# EAGLE design Main Board (EAGLE 6.1)
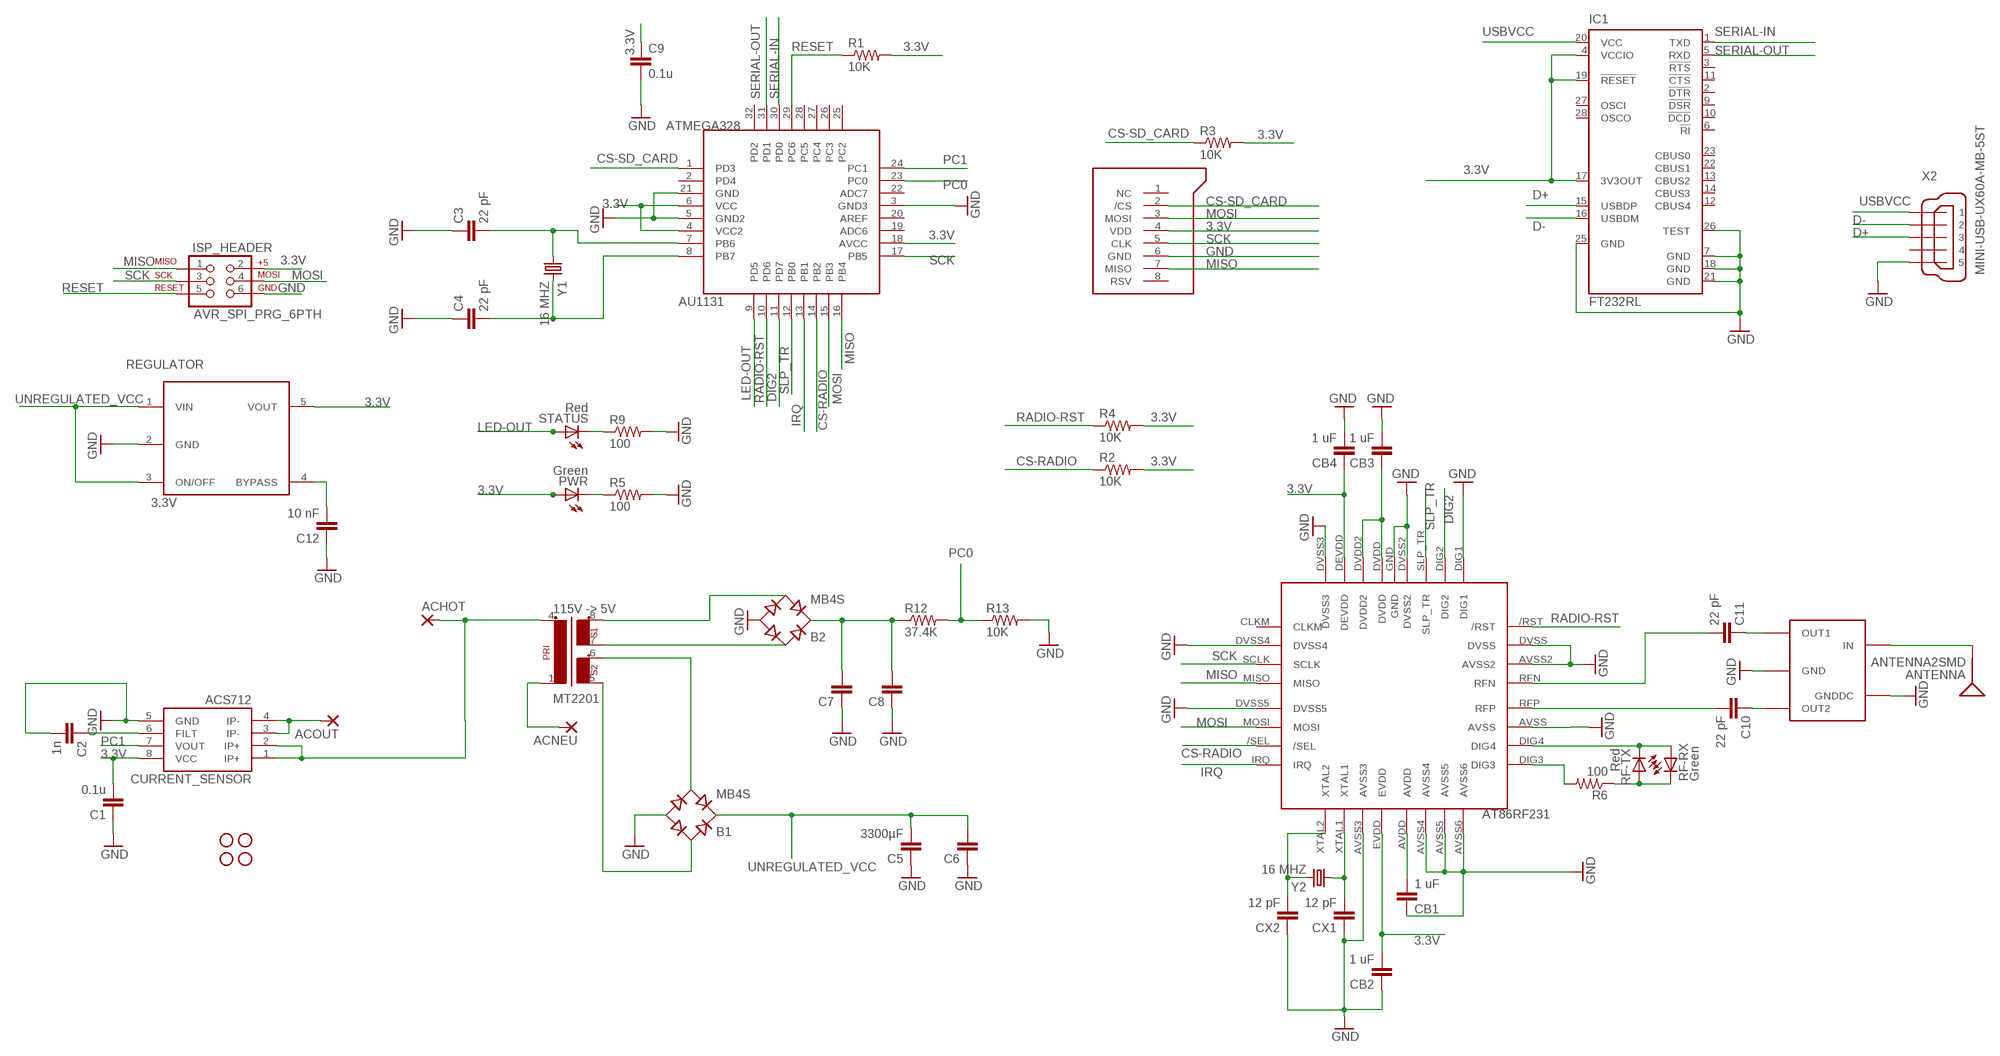
[diagram p0: schematic, sheet 1]

## Parts
3.3V_REGULATOR  REG3.3V  [SOT23-5]
ACHOT  PTH3MM  [PTH-3MM]
ACNEU  PTH3MM  [PTH-3MM]
ACOUT  PTH3MM  [PTH-3MM]
ANTENNA  ANTENNA2SMD  [ANTENNA-CHIP2]
AT86RF231  AT86RF231(RADIO)AT86RF231  [32QN2(RADIO)]
ATMEGA328  ATMEGA32832A  [TQFP32-08]
B1  MB4S  [SOIC-4]
B2  MB4S  [SOIC-4]
BALUN  WE-BAL  [WE-BAL]
C1  0.1u  CAP0603-CAP  [0603-CAP]
C2  1n  CAP0603-CAP  [0603-CAP]
C3  22 pF  CAP0603-CAP  [0603-CAP]
C4  22 pF  CAP0603-CAP  [0603-CAP]
C5  3300µF  CAPPTH1  [CAP-PTH-5MM]
C6  CAPPTH1  [CAP-PTH-5MM]
C7  CAPPTH1  [CAP-PTH-5MM]
C8  CAPPTH1  [CAP-PTH-5MM]
C9  0.1u  CAP0603-CAP  [0603-CAP]
C10  22 pF  CAP0603-CAP  [0603-CAP]
C11  22 pF  CAP0603-CAP  [0603-CAP]
C12  10 nF  CAP0603-CAP  [0603-CAP]
CB1  1 uF  CAP0603-CAP  [0603-CAP]
CB2  1 uF  CAP0603-CAP  [0603-CAP]
CB3  1 uF  CAP0603-CAP  [0603-CAP]
CB4  1 uF  CAP0603-CAP  [0603-CAP]
CURRENT_SENSOR  ACS712  [SO08]
CX1  12 pF  CAP0603-CAP  [0603-CAP]
CX2  12 pF  CAP0603-CAP  [0603-CAP]
IC1  FT232RL  [SSOP28]
ISP_HEADER  AVR_SPI_PRG_6PTH  [2X3]
JP1  STAND-OFF  [STAND-OFF]
JP2  STAND-OFF  [STAND-OFF]
JP3  STAND-OFF  [STAND-OFF]
JP4  STAND-OFF  [STAND-OFF]
MICROSD  MICROSD  [MICRO-SD-SOCKET-PP]
MT2201  115V -> 5V  EI38-2  [EI38-2]
PWR  Green  LED0603  [LED-0603]
R1  10K  RESISTOR0603-RES  [0603-RES]
R2  10K  RESISTOR0603-RES  [0603-RES]
R3  10K  RESISTOR0603-RES  [0603-RES]
R4  10K  RESISTOR0603-RES  [0603-RES]
R5  100  RESISTOR0603-RES  [0603-RES]
R6  100  RESISTOR0603-RES  [0603-RES]
R9  100  RESISTOR0603-RES  [0603-RES]
R12  37.4K  RESISTOR0603-RES  [0603-RES]
R13  10K  RESISTOR0603-RES  [0603-RES]
RF-RX  Green  LED0603  [LED-0603]
RF-TX  Red  LED0603  [LED-0603]
STATUS  Red  LED0603  [LED-0603]
X2  MINI-USB-UX60A-MB-5ST  [UX60A-MB-5ST]
Y1  16 MHZ  CRYSTALSMD  [HC49UP]
Y2  16 MHZ  CRYSTALSMD  [HC49UP]

## Nets
3.3V: 3.3V_REGULATOR.5(VOUT) AT86RF231.DEVDD AT86RF231.EVDD ATMEGA328.4(VCC2) ATMEGA328.6(VCC) ATMEGA328.18(AVCC) C1.2 C9.1 CB2.2 CB4.1 CURRENT_SENSOR.8(VCC) IC1.4(VCCIO) IC1.17(3V3OUT) IC1.19(!RESET) ISP_HEADER.2 MICROSD.4(VDD) PWR.A R1.2 R2.2 R3.2 R4.2
3.3V1: 3.3V_REGULATOR.4(BYPASS) C12.2
CS-RADIO: AT86RF231./SEL ATMEGA328.14(PB2) R2.1
CS-SD_CARD: ATMEGA328.1(PD3) MICROSD.2(/CS) R3.1
D+: IC1.15(USBDP) X2.3
D-: IC1.16(USBDM) X2.2
DIG2: AT86RF231.DIG2 ATMEGA328.11(PD7)
GND: 3.3V_REGULATOR.2(GND) AT86RF231.AVSS AT86RF231.AVSS2 AT86RF231.AVSS3 AT86RF231.AVSS4 AT86RF231.AVSS5 AT86RF231.AVSS6 AT86RF231.DIG1 AT86RF231.DVSS AT86RF231.DVSS2 AT86RF231.DVSS3 AT86RF231.DVSS4 AT86RF231.DVSS5 AT86RF231.GND ATMEGA328.3(GND3) ATMEGA328.5(GND2) ATMEGA328.21(GND) B1.- B2.- BALUN.GND BALUN.GNDDC C1.1 C2.2 C3.1 C4.1 C5.1 C6.1 C7.1 C8.1 C9.2 C12.1 CB1.1 CB2.1 CB3.2 CB4.2 CURRENT_SENSOR.5(GND) CX1.1 CX2.1 IC1.7(GND) IC1.18(GND) IC1.21(GND) IC1.25(GND) IC1.26(TEST) ISP_HEADER.6 MICROSD.6(GND) R5.2 R9.2 R13.2 X2.5
IRQ: AT86RF231.IRQ ATMEGA328.13(PB1)
LED-OUT: ATMEGA328.9(PD5) STATUS.A
MISO: AT86RF231.MISO ATMEGA328.16(PB4) ISP_HEADER.1 MICROSD.7(MISO)
MOSI: AT86RF231.MOSI ATMEGA328.15(PB3) ISP_HEADER.4 MICROSD.3(MOSI)
N$1: ACHOT.1(P) CURRENT_SENSOR.1(IP+) CURRENT_SENSOR.2(IP+) MT2201.4
N$2: ACNEU.1(P) MT2201.1
N$3: B1.~1(AC1) MT2201.5
N$4: B2.~1(AC1) MT2201.7
N$5: B2.~2(AC2) MT2201.8
N$6: B2.+ C7.2 C8.2 R12.1
N$7: PWR.C R5.1
N$8: AT86RF231.DVDD AT86RF231.DVDD2 CB3.1
N$9: ACOUT.1(P) CURRENT_SENSOR.3(IP-) CURRENT_SENSOR.4(IP-)
N$10: AT86RF231.AVDD CB1.2
N$11: AT86RF231.XTAL1 CX1.2 Y2.1
N$12: AT86RF231.XTAL2 CX2.2 Y2.2
N$13: AT86RF231.DIG4 RF-RX.A RF-TX.C
N$14: R6.1 RF-RX.C RF-TX.A
N$15: AT86RF231.DIG3 R6.2
N$16: BALUN.OUT2 C10.1
N$17: BALUN.OUT1 C11.1
N$18: AT86RF231.RFN C11.2
N$19: AT86RF231.RFP C10.2
N$20: ANTENNA.FEED(SIGNAL) BALUN.IN
N$23: B1.~2(AC2) MT2201.6
N$28: C2.1 CURRENT_SENSOR.6(FILT)
N$30: R9.1 STATUS.C
PC0: ATMEGA328.23(PC0) R12.2 R13.1
PC1: ATMEGA328.24(PC1) CURRENT_SENSOR.7(VOUT)
RADIO-RST: AT86RF231./RST ATMEGA328.10(PD6) R4.1
RESET: ATMEGA328.29(PC6) ISP_HEADER.5 R1.1
SCK: AT86RF231.SCLK ATMEGA328.17(PB5) ISP_HEADER.3 MICROSD.5(CLK)
SERIAL-IN: ATMEGA328.30(PD0) IC1.1(TXD)
SERIAL-OUT: ATMEGA328.31(PD1) IC1.5(RXD)
SLP_TR: AT86RF231.SLP_TR ATMEGA328.12(PB0)
UNREGULATED_VCC: 3.3V_REGULATOR.1(VIN) 3.3V_REGULATOR.3(ON/OFF) B1.+ C5.2 C6.2
USBVCC: IC1.20(VCC) X2.1
XTAL1: ATMEGA328.7(PB6) C3.2 Y1.1
XTAL2: ATMEGA328.8(PB7) C4.2 Y1.2
Unconnected: AT86RF231.CLKM ATMEGA328.2(PD4) ATMEGA328.19(ADC6) ATMEGA328.20(AREF) ATMEGA328.22(ADC7) ATMEGA328.25(PC2) ATMEGA328.26(PC3) ATMEGA328.27(PC4) ATMEGA328.28(PC5) ATMEGA328.32(PD2) IC1.2(!DTR) IC1.3(!RTS) IC1.6(!RI) IC1.9(!DSR) IC1.10(!DCD) IC1.11(!CTS) IC1.12(CBUS4) IC1.13(CBUS2) IC1.14(CBUS3) IC1.22(CBUS1) IC1.23(CBUS0) IC1.27(OSCI) IC1.28(OSCO) MICROSD.1(NC) MICROSD.8(RSV) X2.4

## Library data of the parts
3.3V_REGULATOR = group10:REG3.3V
ACHOT ACNEU ACOUT = group10:PTH: THROUGH-HOLE PAD
ANTENNA = SparkFun:ANTENNA2: Antenna Single endded antenna. Common with smaller chip antennas. CHIP4 package is the GPS Chip Antenna SKU: GPS-08418. CHIP5 package is 2.4GHz chip antenna SKU: WRL-00144.
AT86RF231 = group10:AT86RF231(RADIO)
ATMEGA328 = group10:ATMEGA328
B1 B2 = rectifier:MB*S: Bridge Rectifier Source: http://www.fairchildsemi.com/ds/MB/MB6S.pdf
BALUN = group10:WE-BAL
C1-C12 CB1-CB4 CX1 CX2 = SparkFun:CAP: Capacitor Standard 0603 ceramic capacitor, and 0.1" leaded capacitor.
CURRENT_SENSOR = group10:ACS712
IC1 = ftdichip:FT232R: Source: http://www.ftdichip.com/Documents/DataSheets/DS_FT232R_v104.pdf; MPN: FT232RL; OC_FARNELL: 1146032; OC_NEWARK: 91K9918
ISP_HEADER = SparkFun:AVR_SPI_PRG_6: AVR ISP 6 Pin This is the reduced ISP connector for AVR programming. Common on Arduino. This footprint will take up less PCB space and can be used with a 10-pin to 6-pin adapter such as SKU: BOB-08508
JP1-JP4 = SparkFun:STAND-OFF: Stand Off This is the mechanical footprint for a #4 phillips button head screw. Use the keepout ring to avoid running the screw head into surrounding components. SKU : PRT-00447
MICROSD = group10:MICROSD
MT2201 = group10:EI38-2: TRANSFORMER 1 primary winding, 2 secondary windings ERA
PWR RF-RX RF-TX STATUS = SparkFun:LED: LEDs Standard schematic elements and footprints for 5mm, 3mm, 1206, and 0603 sized LEDs. 5mm - Spark Fun Electronics SKU : COM-00529 (and others)
R1-R6 R9 R12 R13 = SparkFun:RESISTOR: Resistor Basic schematic elements and footprints for 0603, 1206, and PTH resistors.
X2 = con-hirose:MINI-USB-: MINI USB Connector Source: http://www.hirose.co.jp/cataloge_hp/e24000019.pdf; OC_FARNELL: unknown; OC_NEWARK: unknown
Y1 Y2 = group10:CRYSTAL: Crystals Various standard crystals. Proven footprints. Spark Fun Electronics SKU : COM-00534

## Board
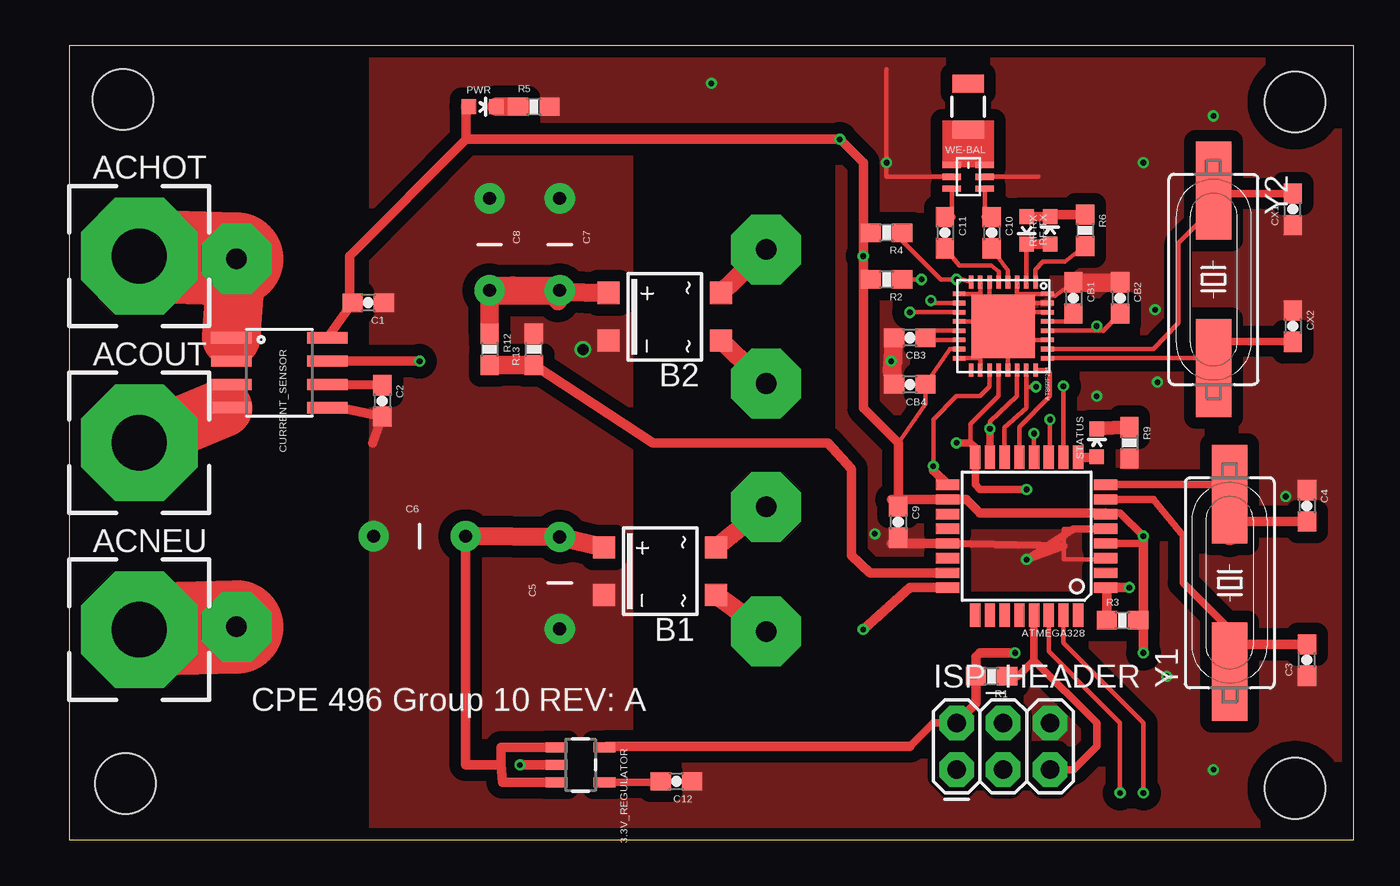
[diagram p1: board, top side]
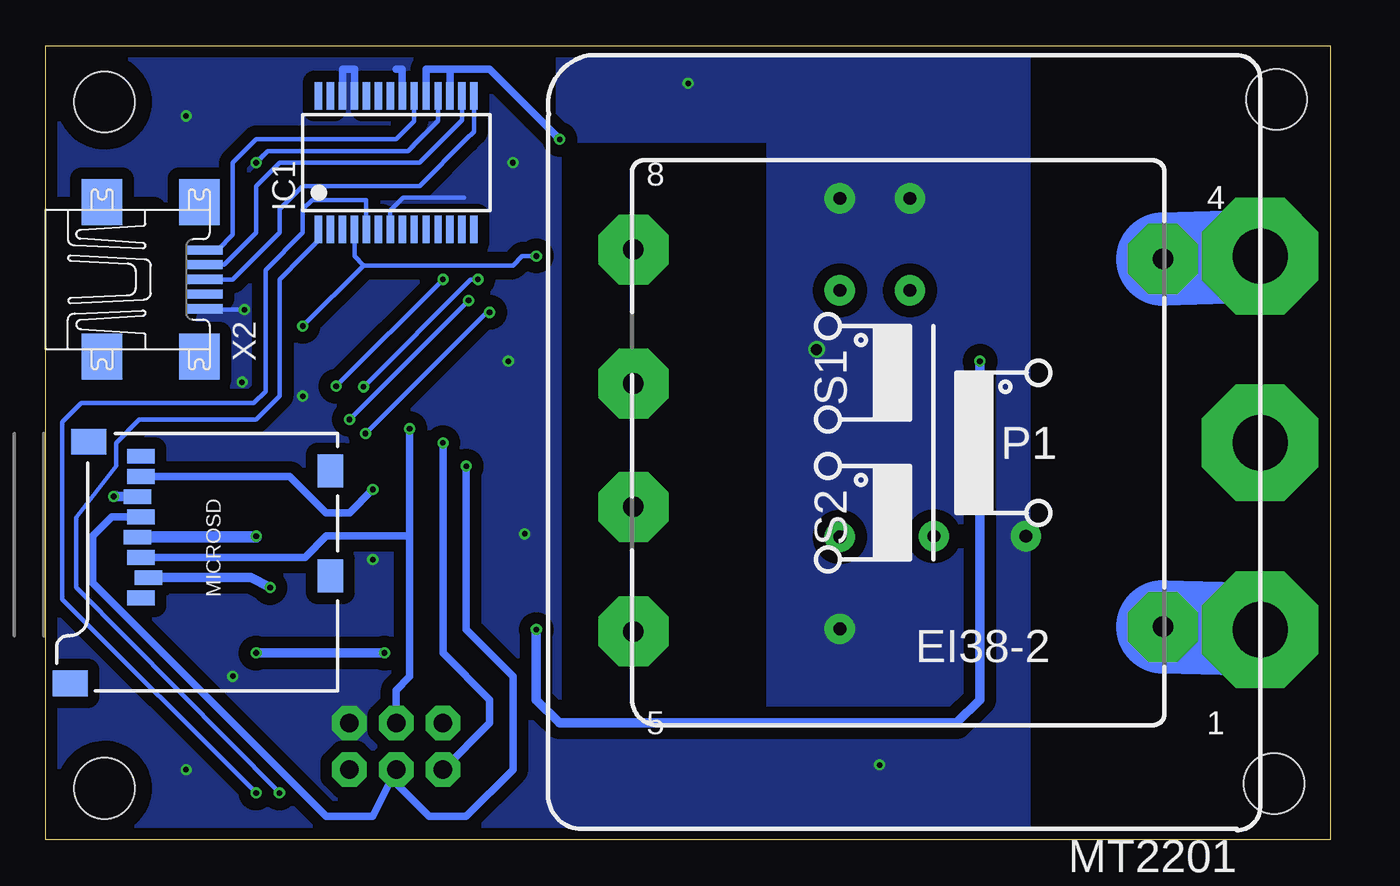
[diagram p2: board, bottom side, seen from below]

Size 69.85 x 43.18 mm. Coordinates in mm from the lower left corner, seen from the top.
Outline: 0,0 69.85,0 69.85,43.18 0,43.18 0,0
Copper layers (1*16): Top 0.035mm / dielectric 1.5mm / Bottom 0.035mm
Design rules: minimum track width 0.15mm, minimum drill 0.3mm, track to track 0.15mm, track to pad 0.15mm, pad to pad 0.15mm, via to via 0.15mm, smd to smd 0.15mm, copper to edge 0.3mm, drill to drill 0.2mm, minimum pad ring 0.2mm, minimum via ring 0.15mm, stop-mask expansion 0.075mm, vias tented up to drill 0mil, thermal gap 0.2mm

### Footprints (pad centres in the part's own frame; a part is rotated, then mirrored left to right if it is on the bottom)
SOT23-5 = smd 0.55 x 1.2: 1 -0.95,-1.3; 2 0,-1.3; 3 0.95,-1.3; 4 0.95,1.3; 5 -0.95,1.3
PTH-3MM = drill 3 pad 6.35 octagon: 1 0,0
ANTENNA-CHIP2 = smd 1.7 x 1: FEED 0,1.25; P$2 0,-1.25
32QN2(RADIO) = smd 0.7 x 0.25: /RST -2.4,-1.75; /SEL 2.4,1.25; AVSS -2.4,0.75; AVSS2 -2.4,-0.75; CLKM 2.4,-1.75; DIG3 -2.4,1.75; DIG4 -2.4,1.25; DVSS -2.4,-1.25; DVSS4 2.4,-1.25; DVSS5 2.4,0.25; IRQ 2.4,1.75; MISO 2.4,-0.25; MOSI 2.4,0.75; RFN -2.4,-0.25; RFP -2.4,0.25; SCLK 2.4,-0.75 | smd 0.25 x 0.7: AVDD -0.25,2.4; AVSS3 0.75,2.4; AVSS4 -0.75,2.4; AVSS5 -1.25,2.4; AVSS6 -1.75,2.4; DEVDD 1.25,-2.4; DIG1 -1.75,-2.4; DIG2 -1.25,-2.4; DVDD 0.25,-2.4; DVDD2 0.75,-2.4; DVSS2 -0.25,-2.4; DVSS3 1.75,-2.4; EVDD 0.25,2.4; SLP_TR -0.75,-2.4; XTAL1 1.25,2.4; XTAL2 1.75,2.4 | smd 3.45 x 3.45: GND 0,0
TQFP32-08 = smd 1.27 x 0.559: 1 -4.293,2.8; 2 -4.293,2; 3 -4.293,1.2; 4 -4.293,0.4; 5 -4.293,-0.4; 6 -4.293,-1.2; 7 -4.293,-2; 8 -4.293,-2.8; 17 4.293,-2.8; 18 4.293,-2; 19 4.293,-1.2; 20 4.293,-0.4; 21 4.293,0.4; 22 4.293,1.2; 23 4.293,2; 24 4.293,2.8 | smd 0.559 x 1.27: 9 -2.8,-4.293; 10 -2,-4.293; 11 -1.2,-4.293; 12 -0.4,-4.293; 13 0.4,-4.293; 14 1.2,-4.293; 15 2,-4.293; 16 2.8,-4.293; 25 2.8,4.293; 26 2,4.293; 27 1.2,4.293; 28 0.4,4.293; 29 -0.4,4.293; 30 -1.2,4.293; 31 -2,4.293; 32 -2.8,4.293
SOIC-4 = smd 1.2 x 1.2: + 1.3,3.05; - -1.3,3.05; ~1 -1.3,-3.05; ~2 1.3,-3.05
WE-BAL = smd 1 x 0.35: GND 0.9,0; GNDDC -0.9,0; IN -0.9,0.65; NC 0.9,0.65; OUT1 -0.9,-0.65; OUT2 0.9,-0.65
0603-CAP = smd 1.1 x 1: 1 -0.85,0; 2 0.85,0
CAP-PTH-5MM = drill 0.7 pad 1.651: 1 -2.5,0; 2 2.5,0
SO08 = smd 0.61 x 2.21: 1 -1.905,-2.616; 2 -0.635,-2.616; 3 0.635,-2.616; 4 1.905,-2.616; 5 1.905,2.616; 6 0.635,2.616; 7 -0.635,2.616; 8 -1.905,2.616
SSOP28 = smd 0.4 x 1.5: 1 -4.225,-3.625; 2 -3.575,-3.625; 3 -2.925,-3.625; 4 -2.275,-3.625; 5 -1.625,-3.625; 6 -0.975,-3.625; 7 -0.325,-3.625; 8 0.325,-3.625; 9 0.975,-3.625; 10 1.625,-3.625; 11 2.275,-3.625; 12 2.925,-3.625; 13 3.575,-3.625; 14 4.225,-3.625; 15 4.225,3.625; 16 3.575,3.625; 17 2.925,3.625; 18 2.275,3.625; 19 1.625,3.625; 20 0.975,3.625; 21 0.325,3.625; 22 -0.325,3.625; 23 -0.975,3.625; 24 -1.625,3.625; 25 -2.275,3.625; 26 -2.925,3.625; 27 -3.575,3.625; 28 -4.225,3.625
2X3 = drill 1.016 pad 1.88 octagon: 1 0,0; 2 0,2.54; 3 2.54,0; 4 2.54,2.54; 5 5.08,0; 6 5.08,2.54
STAND-OFF = hole 3.302: 0,0
MICRO-SD-SOCKET-PP = smd 0.8 x 1.5: 1 -8.94,10.7; 2 -7.84,10.3; 3 -6.74,10.7; 4 -5.64,10.9; 5 -4.54,10.7; 6 -3.44,10.9; 7 -2.34,10.7; 8 -1.24,10.7 | smd 1.8 x 1.4: CD1 -2.05,0.4; CD2 -7.75,0.4 | smd 1.4 x 1.9: GND1 -13.6,14.55; GND3 -0.45,13.55
EI38-2 = drill 1.118 pad 3.81 octagon: 1 -12.497,10.008; 4 -12.497,-10.008; 5 16.307,10.262; 6 16.307,3.48; 7 16.307,-3.226; 8 16.307,-10.516
LED-0603 = smd 0.8 x 0.8: A 0,-0.75; C 0,0.75
0603-RES = smd 1.1 x 1: 1 -0.85,0; 2 0.85,0
UX60A-MB-5ST = smd 2 x 0.5: 1 2.25,1.6; 2 2.25,0.8; 3 2.25,0; 4 2.25,-0.8; 5 2.25,-1.6 | smd 2.2 x 2.5: M1 -3.3,-4.2; M2 -3.3,4.2; M3 2,4.2; M4 2,-4.2
HC49UP = smd 5.334 x 1.93: 1 -4.826,0; 2 4.826,0

### Placement (x,y rotation side)
3.3V_REGULATOR  27.81,4.06 270 top
ACHOT  3.81,31.75 0 top
ACNEU  3.81,11.43 0 top
ACOUT  3.81,21.59 0 top
ANTENNA  48.9,39.88 180 top
AT86RF231  50.8,27.94 270 top
ATMEGA328  52.07,16.51 180 top
B1  32.13,14.61 90 top
B2  32.38,28.45 90 top
BALUN  48.9,36.07 0 top
C1  16.26,29.21 180 top
C2  17.02,23.88 270 top
C3  67.31,9.78 90 top
C4  67.31,18.16 270 top
C5  26.67,13.97 90 top
C6  19.05,16.51 0 top
C7  26.67,32.38 270 top
C8  22.86,32.38 270 top
C9  45.09,17.27 270 top
C10  50.16,33.02 270 top
C11  47.62,33.02 270 top
C12  33.02,3.17 180 top
CB1  54.61,29.46 270 top
CB2  57.15,29.46 270 top
CB3  45.72,27.3 180 top
CB4  45.72,24.77 180 top
CURRENT_SENSOR  11.43,25.4 270 top
CX1  66.55,34.29 90 top
CX2  66.55,27.94 270 top
IC1  50.8,36.83 0 bottom
ISP_HEADER  48.26,3.81 0 top
JP1  3.05,3.05 0 top
JP2  66.67,40.13 0 top
JP3  2.92,40.26 0 top
JP4  66.67,2.79 0 top
MICROSD  53.98,22.1 90 bottom
MT2201  21.59,21.59 180 bottom
PWR  22.48,39.88 270 top
R1  50.16,8.89 180 top
R2  44.45,30.48 180 top
R3  57.28,11.94 0 top
R4  44.45,33.02 180 top
R5  25.27,39.88 0 top
R6  55.24,33.15 270 top
R9  57.66,21.59 270 top
R12  22.86,26.67 270 top
R13  25.27,26.67 90 top
RF-RX  53.34,33.15 0 top
RF-TX  52.07,33.15 180 top
STATUS  55.88,21.59 0 top
X2  63.5,30.48 0 bottom
Y1  63.12,13.97 90 top
Y2  62.23,30.48 270 top

### Tracks (layer width: path | path; a pad name or v marks a point on that pad's centre or on a via)
3.3V  (via drill 0.3, 0.3 pad 0.3)
  Top 0.254: C9.1 44.7,18.51 45.3,18.51 | AT86RF231.DEVDD 47.91,26.69 CB4.1 46.57,23.71 45.09,21.59 | 29.21,5.08 29.11,5.08 3.3V_REGULATOR.5 | CB2.2 56.22,27.68 55.88,27.69 | 55.88,27.69 AT86RF231.EVDD | 55.88,27.69 v55.88,27.94 | 58.13,11.72 58.42,11.72 v58.42,10.16
  Top 0.406: ATMEGA328.4 58.42,16.11 v58.42,16.51 57.15,17.78 56.36,17.78 ATMEGA328.6 | 45.72,5.08 46.99,6.35 ISP_HEADER.2 | C1.2 15.24,29.21
  Top 0.508: CURRENT_SENSOR.8 C1.2 | 44.7,18.51 ATMEGA328.18 48.8,18.51 49.53,17.78 56.36,17.78 | v58.42,16.51 v58.42,10.16 | 21.59,38.1 15.24,31.75 15.24,29.21 | 21.59,38.1 v41.91,38.1 43.18,36.83 43.18,33.02 | 45.72,5.08 29.21,5.08 | R3.2 58.13,11.72 | 21.69,39.88 21.59,39.88 21.59,38.1 | 43.18,33.02 v43.18,31.75 43.18,30.48 | 43.18,30.48 43.18,23.5 45.09,21.59 C9.1 | R4.2 43.18,33.02 | R2.2 43.18,30.48 | ISP_HEADER.2 49.31,7.41 R1.2 49.31,9.95 49.53,10.16 v51.44,10.16
  Top 0.762: PWR.A 21.69,39.88
  Bottom 0.254: 52.58,31.24 44.45,31.24 43.94,31.75 v43.18,31.75 | IC1.4 53.08,31.74 52.58,31.24 | 52.58,31.24 v55.88,27.94 | 47.88,41.91 48.26,41.91
  Bottom 0.406: IC1.19 49.17,41.91 48.26,41.91 45.72,41.91 v41.91,38.1 | IC1.17 47.88,41.91
  Bottom 0.508: v51.44,10.16 v58.42,10.16
  Bottom 0.635: MICROSD.4 58.42,16.46 v58.42,16.51
3.3V1
  Top 0.406: 3.3V_REGULATOR.4 32.17,3.11 C12.2
CS-RADIO  (via drill 0.3 pad 0.3)
  Top 0.254: ATMEGA328.14 50.87,22.43 52.05,23.5 52.05,24.13 | v46.35,30.48 R2.1 | AT86RF231./SEL 52.05,24.13 | v52.58,24.64 52.05,24.64 52.05,24.13
  Bottom 0.254: v46.35,30.48 46.75,30.48 v52.58,24.64
CS-SD_CARD  (via drill 0.3)
  Top 0.508: v57.66,13.72 57.4,13.71 ATMEGA328.1 56.43,13.65 R3.1
  Bottom 0.508: MICROSD.2 58.71,14.26 v57.66,13.72
D+
  Bottom 0.254: X2.3 59.69,30.48 57.15,33.02 57.15,34.29 55.88,35.56 49.53,35.56 46.99,38.1 46.58,38.52 IC1.15
D-
  Bottom 0.254: X2.2 60.16,31.28 58.42,33.02 58.42,35.56 57.15,36.83 49.53,36.83 48.26,38.1 47.23,39.13 IC1.16
DIG2  (via drill 0.3 pad 0.3)
  Top 0.254: ATMEGA328.11 53.34,20.87 v53.34,22.86 | AT86RF231.DIG2 47.01,29.19 v46.86,29.34
  Bottom 0.254: v53.34,22.86 v46.86,29.34
GND  (via drill 0.3, 0.3 pad 0.3, 0.6)
  Top 0.254: 44.7,16.11 C9.2 | ATMEGA328.5 54.1,16.91 54.1,15.24 55.88,15.24 55.88,15.31 ATMEGA328.3 | 26.25,39.92 26.25,39.88 | BALUN.GNDDC 47.62,36.07 44.45,36.07 v44.45,36.83 44.45,41.91 | BALUN.GND 52.7,36.07 | CB1.1 53.6,29.56 AT86RF231.AVSS6 51.55,29.69 AT86RF231.AVSS 51.55,27.94 AT86RF231.GND | AT86RF231.DVSS2 50.8,28.19 AT86RF231.GND | AT86RF231.DVSS4 49.55,26.67 | 49.55,26.67 49.55,27.94 | 49.55,27.94 AT86RF231.GND | AT86RF231.DVSS5 51.05,27.94 AT86RF231.GND | AT86RF231.DVSS 49.55,29.21 | 49.55,29.21 49.55,27.94 | 49.55,27.94 AT86RF231.GND | AT86RF231.AVSS3 50.8,27.19 AT86RF231.GND | AT86RF231.AVSS2 50.05,27.94 AT86RF231.GND | AT86RF231.AVSS4 50.8,28.69 AT86RF231.GND | AT86RF231.AVSS5 50.8,29.19 AT86RF231.GND | AT86RF231.DIG1 49.55,29.69 49.55,29.21 | AT86RF231.DVSS3 49.55,26.19 49.55,26.67
  Top 0.406: ATMEGA328.21 54.1,15.98 v52.07,15.24 54.61,16.91 ATMEGA328.5
  Top 0.508: CURRENT_SENSOR.5 14.82,23.5 C2.2 16.51,21.59 | 3.3V_REGULATOR.2 25.27,4.06 v24.51,4.06 | ATMEGA328.21 44.7,16.11
  Top 1: CB3.2 44.83,27.3 44.83,26.04
  Top 1.016: CB3.2 44.74,25.53 CB4.2 | CB2.1 CB1.1
  Bottom 0.254: IC1.7 51.12,34.21 50.41,34.92 47.12,34.92 | IC1.18 48.52,39.1 49.53,38.1 50.16,37.47 57.78,37.47 v58.42,36.83 | 61.59,28.83 v59.05,28.83
  Bottom 0.406: 50.48,41.91 IC1.21 50.48,41.91 | 50.48,41.91 50.8,41.91 | IC1.26 53.73,41.91 53.34,41.91 53.08,41.91 IC1.25
  Bottom 0.508: MICROSD.6 66.04,18.66
  other vias: 34.92,41.15 27.94,26.67 62.23,3.81 44.7,26.04 55.88,24.13 62.23,39.37 66.17,18.67 43.81,16.64 59.69,8.89 59.18,24.89
  pour Bottom (isolate 0.635, no thermals): 69.85,43.18 41.91,43.18 41.91,0 69.85,0
  pour Top (isolate 0.635, no thermals): 41.91,43.18 69.85,43.18 69.85,0 41.91,0
  pour Top (isolate 0.635, no thermals): 16.51,0 16.51,43.18 30.48,43.18 30.48,0
  pour Top (isolate 0.635, no thermals): 41.91,38.1 41.91,43.18 30.48,43.18 30.48,38.1
  pour Bottom (isolate 0.635, no thermals): 16.51,0 16.51,43.18 30.48,43.18 30.48,0
  pour Bottom (isolate 0.635, no thermals): 30.48,43.18 30.48,38.1 41.91,38.1 41.91,43.18
  pour Top (isolate 0.635, no thermals): 30.35,5.33 30.48,0 45.72,0 45.72,5.08
  pour Bottom (isolate 0.635, no thermals): 22.86,0 22.86,6.35 46.99,6.35 46.99,0
IRQ
  Top 0.254: ATMEGA328.13 51.67,22.46 53.34,24.13 53.34,25.4 53.2,25.54 AT86RF231.IRQ
LED-OUT
  Top 0.508: STATUS.A 55.84,20.8 ATMEGA328.9
MISO  (via drill 0.3)
  Top 0.254: AT86RF231.MISO 50.54,25.66 50.54,24.13 49.01,22.6 49.01,21.59
  Top 0.406: v52.07,19.05 49.53,19.05 49.27,19.31 ATMEGA328.16 49.27,21.33 49.01,21.59 v48.26,21.59
  Bottom 0.406: ISP_HEADER.1 45.72,6.35 45.72,7.62 48.26,10.16 v48.26,21.59 | MICROSD.7 56.59,19.76 54.61,17.78 53.34,17.78 v52.07,19.05
MOSI  (via drill 0.3)
  Top 0.254: AT86RF231.MOSI 51.55,24.13 50.07,22.74 v50.07,22.35
  Top 0.406: ATMEGA328.15 v50.07,22.35
  Bottom 0.406: ISP_HEADER.4 50.8,8.13 50.07,8.89 50.07,16.51 | MICROSD.3 55.76,15.36 54.61,16.51 50.07,16.51 | 50.07,16.51 v50.07,22.35
N$1
  Top 0.254: CURRENT_SENSOR.2 CURRENT_SENSOR.1
  Top 3.175: CURRENT_SENSOR.1 MT2201.4
  Top 5.08: MT2201.4 ACHOT.1
  Bottom 5.08: MT2201.4 ACHOT.1
N$2
  Top 5.08: MT2201.1 ACNEU.1
  Bottom 5.08: MT2201.1 ACNEU.1
N$3
  Top 1.016: MT2201.5 B1.~1
N$4
  Top 1.016: B2.~1 MT2201.7
N$5
  Top 1.016: B2.~2 MT2201.8
N$6
  Top 1.016: 26.58,29.3 C7.2 | B2.+ C8.2 R12.1
  Top 1.524: C8.2 24.13,29.89 C7.2
N$7
  Top 1.016: R5.1 PWR.C
N$8
  Top 0.254: CB3.1 46.66,27.21 | AT86RF231.DVDD2 46.57,27.19 CB3.1 | AT86RF231.DVDD 46.57,27.69 CB3.1
N$9
  Top 0.254: 8.38,23.5 CURRENT_SENSOR.4 CURRENT_SENSOR.3
  Top 3.175: 8.38,23.5 ACOUT.1
N$10
  Top 0.254: AT86RF231.AVDD 54.15,28.19 CB1.2
N$11
  Top 0.254: 62.23,35.56 Y2.1 | 62.23,34.67 62.23,34.36 60.33,32.45 60.33,28.1 58.97,26.69 AT86RF231.XTAL1
  Top 0.406: CX1.2 62.23,35.14 Y2.1
  Top 1.016: 62.23,34.67 Y2.1 62.23,35.56
N$12
  Top 0.254: 62.23,26.27 62.38,26.27 | Y2.2 62.23,26.27 | 62.23,26.27 62.23,25.83 62.67,26.19 AT86RF231.XTAL2
  Top 0.406: CX2.2 62.23,27.09 Y2.2
N$13
  Top 0.254: AT86RF231.DIG4 52.05,32.25
  Top 0.406: 52.05,32.25 RF-TX.C
  Top 0.508: RF-TX.C RF-RX.A
N$14
  Top 0.254: 53.44,34 RF-RX.C
  Top 0.508: RF-RX.C RF-TX.A | R6.1 53.44,34
N$15
  Top 0.254: AT86RF231.DIG3 52.55,31.02 52.95,31.45 54.15,31.45 R6.2
N$16
  Top 0.254: 49.78,35.41 BALUN.OUT2 49.8,33.87
  Top 0.381: 49.8,33.87 C10.1
N$17
  Top 0.254: BALUN.OUT1 48.01,35.41 48.01,33.87
  Top 0.406: 48.01,33.87 C11.1
N$18
  Top 0.254: AT86RF231.RFN 50.55,30.9 50.16,31.24 48.43,31.24 C11.2
N$19
  Top 0.254: AT86RF231.RFP 51.05,30.97 C10.2
N$20
  Top 0.254: ANTENNA.FEED BALUN.IN
N$23
  Top 1.016: MT2201.6 B1.~2
N$28
  Top 0.508: C2.1 CURRENT_SENSOR.6
N$30
  Top 0.762: R9.1 STATUS.C
PC0
  Top 0.508: ATMEGA328.23 43.54,14.51 42.55,15.48 42.55,20.17 41.27,21.59 31.75,21.59 R13.1
  Top 1.016: R13.1 R12.2
PC1  (via drill 0.3)
  Top 0.508: ATMEGA328.24 45.72,13.71 v43.18,11.43 | CURRENT_SENSOR.7 v19.05,26.04
  Bottom 0.508: v43.18,11.43 43.18,7.62 41.91,6.35 20.32,6.35 19.05,7.62 v19.05,26.04
RADIO-RST  (via drill 0.3 pad 0.3)
  Top 0.254: ATMEGA328.10 v54.07,24.67 | AT86RF231./RST 48.51,30.48 v48.26,30.48 47.41,30.48 45.3,32.59 R4.1
  Bottom 0.254: v54.07,24.67 v48.26,30.48
RESET
  Top 0.406: ATMEGA328.29 52.47,9.76 | 52.47,9.76 55.88,6.35 | 55.88,6.35 55.88,5.08 54.61,3.81 ISP_HEADER.5 | 55.88,5.71 55.88,6.35 | 52.47,9.76 51.6,8.89 R1.1
SCK  (via drill 0.3)
  Top 0.254: AT86RF231.SCLK 50.05,24.65 49.53,24.13 48.26,24.13 46.99,22.86 v46.99,20.32
  Top 0.508: ATMEGA328.17 46.99,20.1 v46.99,20.32
  Bottom 0.406: v46.99,20.32 46.99,11.43 44.45,8.89 44.45,3.81 46.99,1.27 49,1.27 50.8,3.07 ISP_HEADER.3 52.07,1.27 54.61,1.27 67.31,13.97 67.31,16.51 66.26,17.56 MICROSD.5
SERIAL-IN  (via drill 0.3)
  Top 0.254: v57.15,2.54 57.15,6.35 55.88,7.62 53.27,10.23 ATMEGA328.30
  Bottom 0.254: IC1.1 55.02,32.6 55.88,31.75 57.15,30.48 57.15,24.13 58.42,22.86 59.69,22.86 64.77,22.86 66.04,21.59 66.04,20.32 68.2,17.53 68.2,13.72 v57.15,2.54
SERIAL-OUT  (via drill 0.3)
  Top 0.254: ATMEGA328.31 54.07,10.7 58.42,6.35 v58.42,2.54
  Bottom 0.254: IC1.5 52.42,34.8 55.37,34.8 55.88,34.29 55.88,33.02 57.91,30.99 57.91,24.38 58.55,23.75 67.94,23.75 68.96,22.73 68.96,13.08 v58.42,2.54
SLP_TR  (via drill 0.3 pad 0.3)
  Top 0.254: AT86RF231.SLP_TR v45.72,28.69 | ATMEGA328.12 v52.47,22.1
  Bottom 0.254: v52.47,22.1 45.95,28.62 v45.72,28.69
UNREGULATED_VCC
  Top 0.508: 3.3V_REGULATOR.1 23.5,5.01 23.5,4.06 | C6.2 21.55,4.06 23.5,4.06 | 3.3V_REGULATOR.3 23.56,3.11 23.5,4.06
  Top 1.016: C6.2 C5.2 B1.+
USBVCC
  Bottom 0.254: X2.1 60.52,32.08 59.69,32.91 59.69,36.83 58.42,38.1 55.88,38.1 50.8,38.1 49.83,39.08 IC1.20
XTAL1
  Top 0.254: Y1.1 63.12,10.63
  Top 0.406: ATMEGA328.7 58.96,18.51 60.58,16.51 60.58,13.97 63.12,11.43
  Top 0.508: C3.2 63.12,10.63 63.12,11.43
XTAL2
  Top 0.406: ATMEGA328.8 63.12,19.31 Y1.2
  Top 0.508: C4.2 63.12,17.31 63.12,17.78
  Top 1.016: 63.12,16.51 63.12,17.78 Y1.2
(copper drawn outside any net)
  shapes: Top area x1

### Text on the board
tPlace: CPE 496 Group 10 REV: A